# EAGLE design Grove - Serial MP3 Player (EAGLE 6.3)
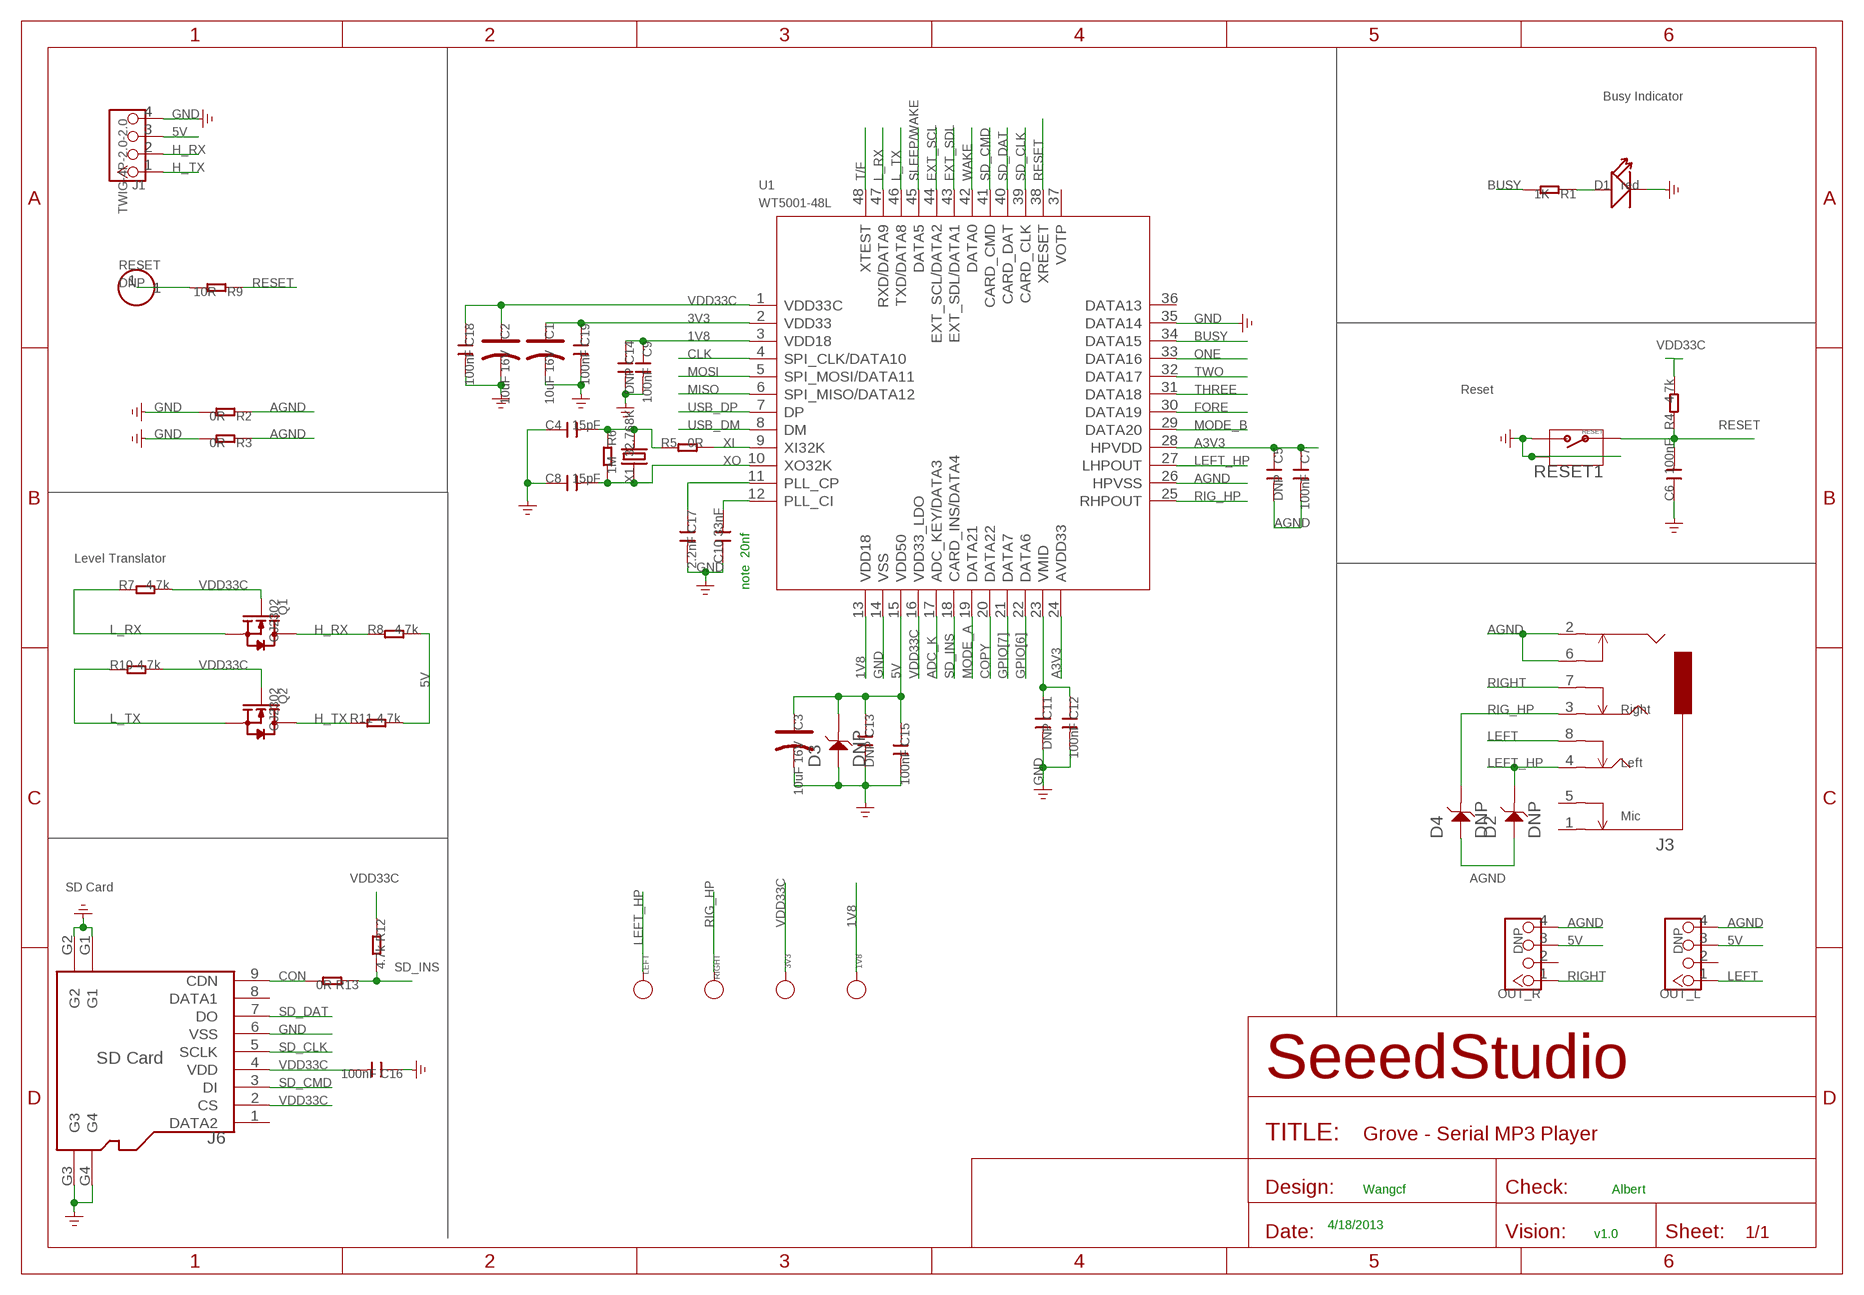
[diagram p0: schematic, sheet 1]

## Parts
1V8  PAD-TEST-POINT'4545'  [TP_4545]
3V3  PAD-TEST-POINT'4545'  [TP_4545]
C1  10uF 16V  CAP-AVX-A  [AVX-A]
C2  10uF 16V  CAP-AVX-A  [AVX-A]
C3  10uF 16V  CAP-AVX-A  [AVX-A]
C4  15pF  C-0603  [C0603]
C5  DNP  C-0805  [C0805]
C6  100nF  C-0603  [C0603]
C7  100nF  C-0603  [C0603]
C8  15pF  C-0603  [C0603]
C9  100nF  C-0603  [C0603]
C10  33nF  C-0603  [C0603]
C11  DNP  C-0805  [C0805]
C12  100nF  C-0603  [C0603]
C13  DNP  C-0805  [C0805]
C14  DNP  C-0805  [C0805]
C15  100nF  C-0603  [C0603]
C16  100nF  C-0603  [C0603]
C17  2.2nF  C-0603  [C0603]
C18  100nF  C-0603  [C0603]
C19  100nF  C-0603  [C0603]
D1  red  LED'0603'  [LED-0603]
D2  DNP  D-ESD-2P'CESD5V0D1'  [SOD123-2.7X1.6]
D3  DNP  D-ESD-2P'CESD5V0D1'  [SOD123-2.7X1.6]
D4  DNP  D-ESD-2P'CESD5V0D1'  [SOD123-2.7X1.6]
J1  TWIG-4P-2.0-2.0  [4P-2.0]
J3  AUDIO-8P-SMD'PJ-3536-L6S'  [8P-3.5-SMD]
J6  SD Card  HOLDER-MICROSD-9P  [9P-SMD-W/-RING]
LEFT  PAD-TEST-POINT'4545'  [TP_4545]
OUT_L  DNP  TWIG-4P-2.0-2.0  [4P-2.0]
OUT_R  DNP  TWIG-4P-2.0-2.0  [4P-2.0]
Q1  CJ2302  MOSFET-N'SOT23'  [SOT23]
Q2  CJ2302  MOSFET-N'SOT23'  [SOT23]
R1  1K  R-0603  [R0603]
R2  0R  R-0603  [R0603]
R3  0R  R-0603  [R0603]
R4  4.7k  R-0603  [R0603]
R5  0R  R-0603  [R0603]
R6  1M  R-0603  [R0603]
R7  4.7k  R-0603  [R0603]
R8  4.7k  R-0603  [R0603]
R9  10R  R-0603  [R0603]
R10  4.7k  R-0603  [R0603]
R11  4.7k  R-0603  [R0603]
R12  4.7k  R-0603  [R0603]
R13  0R  R-0603  [R0603]
RESET  DNP  HEADER-1P-35  [1P-65/35MIL]
RESET1  RESET  BUTTON-4P-REINFORCE'TS-1188E'  [4P-SMD-7X3.5X3.5H]
RIGHT  PAD-TEST-POINT'4545'  [TP_4545]
U1  WT5001-48L  [TQFP48]
X1  32.768K  CRYSTAL-3215  [2P-SMD-3.2X1.5]

## Nets
1V8: 1V8.T C9.1 C14.1 U1.3(VDD18) U1.13(VDD18)
3V3: C1.+ C19.1 U1.2(VDD33)
5V: C3.+ C13.1 C15.1 D3.2 J1.3 OUT_L.3 OUT_R.3 R8.2 R11.2 U1.15(VDD50)
A3V3: C5.1 C7.1 U1.24(AVDD33) U1.28(HPVDD)
ADC_K: U1.17(ADC_KEY/DATA3)
AGND: C5.2 C7.2 D2.1 D4.1 J3.2 J3.6 OUT_L.4 OUT_R.4 R2.1 R3.1 U1.26(HPVSS)
BUSY: R1.2 U1.34(DATA15)
CLK: U1.4(SPI_CLK/DATA10)
CON: J6.9(CDN) R13.2
COPY: U1.20(DATA22)
EXT_SCL: U1.44(EXT_SCL/DATA2)
EXT_SDL: U1.43(EXT_SDL/DATA1)
FORE: U1.30(DATA19)
GND: C1.- C2.- C3.- C4.1 C6.1 C8.1 C9.2 C10.1 C11.2 C12.2 C13.2 C14.2 C15.2 C16.1 C17.2 C18.2 C19.2 D1.- D3.1 J1.4 J6.6(VSS) J6.G1 J6.G2 J6.G3 J6.G4 R2.2 R3.2 RESET1.2 RESET1.S1 RESET1.S2 U1.14(VSS) U1.35(DATA14)
GPIO[6]: U1.22(DATA6)
GPIO[7]: U1.21(DATA7)
H_RX: J1.2 Q1.3(D) R8.1
H_TX: J1.1 Q2.3(D) R11.1
L_RX: Q1.2(S) R7.1 U1.47(RXD/DATA9)
L_TX: Q2.2(S) R10.1 U1.46(TXD/DATA8)
LEFT: J3.8 OUT_L.1
LEFT_HP: D2.2 J3.4 LEFT.T U1.27(LHPOUT)
LL: C4.2 R5.1 R6.1 X1.2
MISO: U1.6(SPI_MISO/DATA12)
MODE_A: U1.19(DATA21)
MODE_B: U1.29(DATA20)
MOSI: U1.5(SPI_MOSI/DATA11)
N$1: C17.1 U1.11(PLL_CP)
N$2: C10.2 U1.12(PLL_CI)
N$3: C11.1 C12.1 U1.23(VMID)
N$4: R9.2 RESET.1
N$10: D1.+ R1.1
ONE: U1.33(DATA16)
RESET: C6.2 R4.1 R9.1 RESET1.1 U1.38(XRESET)
RIG_HP: D4.2 J3.3 RIGHT.T U1.25(RHPOUT)
RIGHT: J3.7 OUT_R.1
SD_CLK: J6.5(SCLK) U1.39(CARD_CLK)
SD_CMD: J6.3(DI) U1.41(CARD_CMD)
SD_DAT: J6.7(DO) U1.40(CARD_DAT)
SD_INS: R12.2 R13.1 U1.18(CARD_INS/DATA4)
SLEEP/WAKE: U1.45(DATA5)
T/F: U1.48(XTEST)
THREE: U1.31(DATA18)
TWO: U1.32(DATA17)
USB_DM: U1.8(DM)
USB_DP: U1.7(DP)
VDD33C: 3V3.T C2.+ C16.2 C18.1 J6.2(CS) J6.4(VDD) Q1.1(G) Q2.1(G) R4.2 R7.2 R10.2 R12.1 U1.1(VDD33C) U1.16(VDD33_LDO)
WAKE: U1.42(DATA0)
XI: R5.2 U1.9(XI32K)
XO: C8.2 R6.2 U1.10(XO32K) X1.1
Unconnected: J3.1 J3.5 J6.1(DATA2) J6.8(DATA1) OUT_L.2 OUT_R.2 U1.36(DATA13) U1.37(VOTP)

## Notes on the sheet
- Busy Indicator
- Reset
- Level Translator
- note  20nf
- Right
- Left
- Mic
- SD Card
- Wangcf | Albert
- 4/18/2013
- v1.0

## Library data of the parts
1V8 3V3 LEFT RIGHT = Discrete:PAD-TEST-POINT; PARTNO: DNP
C1-C3 = Discrete:CAP*: Electrolytic Capacitors,Tantalum Capacitors and Super Capacitors
C4-C19 = Discrete:C*: Ceramic Capacitors
D1 = Discrete:LED*
D2-D4 = Discrete:D-ESD-2P: Diodes for Protectiong against ESD
J1 OUT_L OUT_R = Connector:TWIG-4P-2.0
J3 = Connector:AUDIO-8P-SMD
J6 = Connector:HOLDER-MICROSD-9P
Q1 Q2 = Discrete:MOSFET-N: IRLL014: http://www.vishay.com/docs/91319/sihll014.pdf
R1-R13 = Discrete:R*
RESET = Connector:HEADER-1P
RESET1 = Discrete:BUTTON-4P-REINFORCE: TS-1188E http://www.best-dz.com/?thread-374-2.html
U1 = template:WT5001-48L
X1 = Discrete:CRYSTAL*: CRYSTAL

## Net classes
0 default: width 0.152 mm, drill 0.305 mm, clearance 0.152 mm

## Board
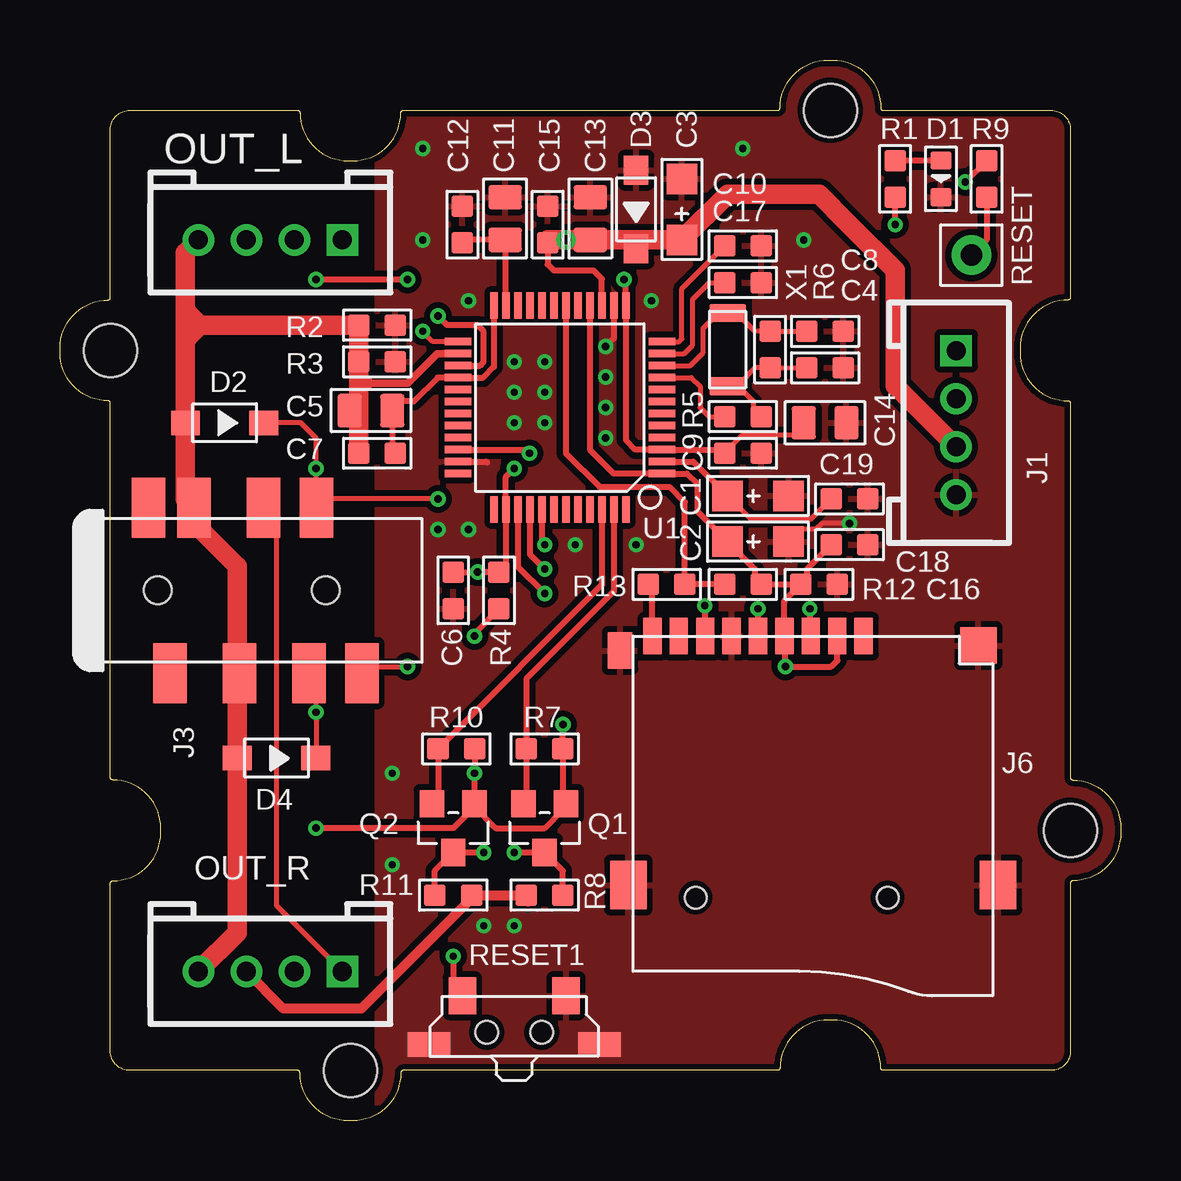
[diagram p1: board, top side]
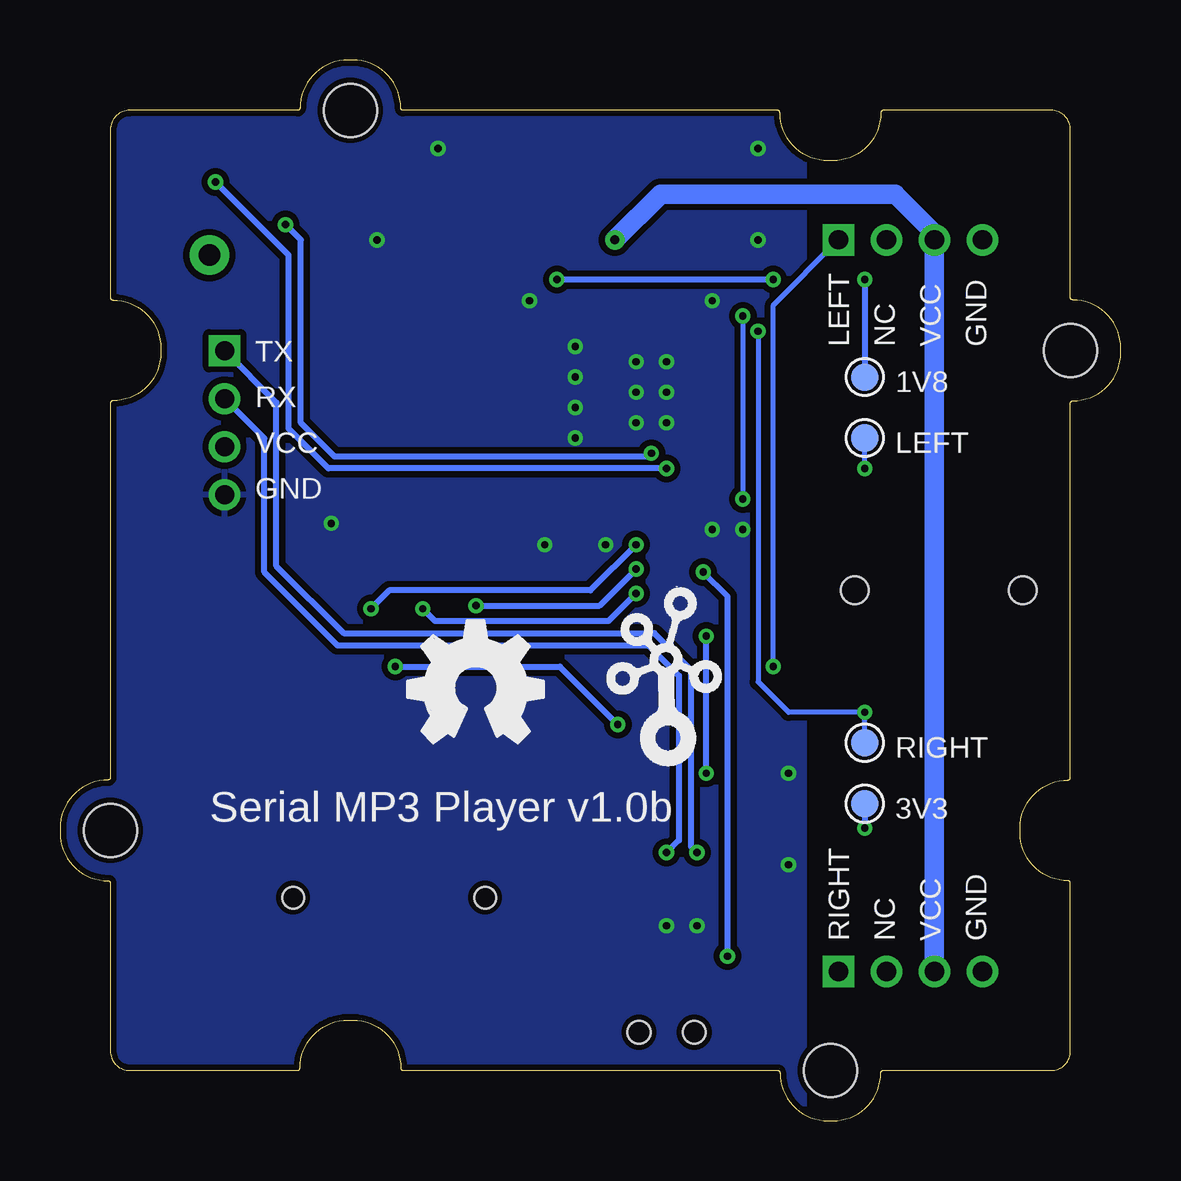
[diagram p2: board, bottom side, seen from below]

Size 44.2 x 44.2 mm. Coordinates in mm from the lower left corner, seen from the top.
Copper layers (1*16): Top 0.035mm / dielectric 1.5mm / Bottom 0.035mm
Design rules "SeeedStudio_rule_no_angle_090911 *": minimum track width 6mil, minimum drill 12mil, track to track 6mil, track to pad 6mil, pad to pad 6mil, via to via 6mil, smd to smd 0mil, copper to edge 10mil, drill to drill 10mil, minimum pad ring 10mil, minimum via ring 6mil, stop-mask expansion 2mil, vias tented up to drill 25mil, thermal gap 10mil

### Footprints (pad centres in the part's own frame; a part is rotated, then mirrored left to right if it is on the bottom)
TP_4545 = smd 1.143 x 1.143: T 0,0
AVX-A = smd 1.27 x 1.27: + -1.27,0; - 1.27,0
C0603 = smd 0.889 x 0.889: 1 -0.762,0; 2 0.762,0
C0805 = smd 1.016 x 1.397: 1 -0.889,0; 2 0.889,0
LED-0603 = smd 0.762 x 0.889: + -0.762,0; - 0.762,0
SOD123-2.7X1.6 = smd 1.2 x 1.02: 1 -1.635,0; 2 1.635,0
4P-2.0 = drill 0.8 pad 1.27 square: 1 -3,0 | drill 0.8 pad 1.27: 2 -1,0; 3 1,0; 4 3,0
8P-3.5-SMD = smd 1.4 x 2.5: 1 2.8,-3.45; 2 5.7,-3.45; 3 8.6,-3.45; 4 8.9,3.45; 5 1.9,3.45; 6 3.8,3.45; 7 6.7,3.45; 8 10.8,-3.45 | hole 1.149: 2.3,0; 9.3,0
9P-SMD-W/-RING = smd 1.524 x 0.762: 1 0,4.4; 2 0,3.3; 3 0,2.2; 4 0,1.1; 5 0,0; 6 0,-1.1; 7 0,-2.2; 8 0,-3.3; 9 0,-4.4 | smd 1.524 x 1.016: G1 0.6,-5.746 | smd 2.032 x 1.524: G2 10.373,-5.4; G3 10.373,10 | smd 1.524 x 1.524: G4 0.392,9.181 | hole 0.889: 10.9,-2.6; 10.9,5.4
SOT23 = smd 1.016 x 1.143: 1 -0.889,-1.016; 2 0.889,-1.016; 3 0,1.016
R0603 = smd 0.889 x 0.889: 1 -0.762,0; 2 0.762,0
1P-65/35MIL = drill 0.889 pad 1.651: 1 0,0
4P-SMD-7X3.5X3.5H = smd 1.143 x 1.524: 1 -2.159,1.524; 2 2.159,1.524 | smd 1.778 x 1.016: S1 -3.556,-0.508; S2 3.556,-0.508 | hole 0.95: -1.15,0; 1.15,0
TQFP48 = smd 1.1 x 0.3: 1 -4.25,2.75; 2 -4.25,2.25; 3 -4.25,1.75; 4 -4.25,1.25; 5 -4.25,0.75; 6 -4.25,0.25; 7 -4.25,-0.25; 8 -4.25,-0.75; 9 -4.25,-1.25; 10 -4.25,-1.75; 11 -4.25,-2.25; 12 -4.25,-2.75; 25 4.25,-2.75; 26 4.25,-2.25; 27 4.25,-1.75; 28 4.25,-1.25; 29 4.25,-0.75; 30 4.25,-0.25; 31 4.25,0.25; 32 4.25,0.75; 33 4.25,1.25; 34 4.25,1.75; 35 4.25,2.25; 36 4.25,2.75 | smd 0.3 x 1.1: 13 -2.75,-4.25; 14 -2.25,-4.25; 15 -1.75,-4.25; 16 -1.25,-4.25; 17 -0.75,-4.25; 18 -0.25,-4.25; 19 0.25,-4.25; 20 0.75,-4.25; 21 1.25,-4.25; 22 1.75,-4.25; 23 2.25,-4.25; 24 2.75,-4.25; 37 2.75,4.25; 38 2.25,4.25; 39 1.75,4.25; 40 1.25,4.25; 41 0.75,4.25; 42 0.25,4.25; 43 -0.25,4.25; 44 -0.75,4.25; 45 -1.25,4.25; 46 -1.75,4.25; 47 -2.25,4.25; 48 -2.75,4.25
2X2U-DIM-W/-DRILL = hole 2.2: 10,20; -20,10; -10,-20; 20,-10
2P-SMD-3.2X1.5 = smd 0.762 x 1.524: 1 -1.524,0; 2 1.524,0

### Placement (x,y rotation side)
1V8  10.67,30.99 0 bottom
3V3  10.67,13.21 0 bottom
C1  29.09,26.04 0 top
C2  29.09,24.13 0 top
C3  25.91,37.98 90 top
C4  31.88,31.37 180 top
C5  12.96,29.59 180 top
C6  16.39,22.1 90 top
C7  13.21,27.82 180 top
C8  31.88,32.9 180 top
C9  28.45,27.82 0 top
C10  28.45,36.45 180 top
C11  18.54,37.59 90 top
C12  16.77,37.34 90 top
C13  22.1,37.59 90 top
C14  31.88,29.09 0 top
C15  20.32,37.34 90 top
C16  31.62,22.35 180 top
C17  28.45,34.93 0 top
C18  32.9,24.01 0 top
C19  32.9,25.91 0 top
D1  36.7,39.25 270 top
D2  6.86,29.09 0 top
D3  24.01,37.98 270 top
D4  9.02,15.12 0 top
J1  37.34,29.09 270 top
J3  1.78,22.1 0 top
J6  29.09,20.2 270 top
LEFT  10.67,28.45 0 bottom
OUT_L  8.77,36.7 180 top
OUT_R  8.77,6.23 180 top
Q1  20.2,12.19 180 top
Q2  16.39,12.19 180 top
R1  34.8,39.25 270 top
R2  13.21,33.15 0 top
R3  13.21,31.62 0 top
R4  18.29,22.1 270 top
R5  28.45,29.34 180 top
R6  29.59,32.13 90 top
R7  20.2,15.5 0 top
R8  20.2,9.4 180 top
R9  38.61,39.25 270 top
R10  16.51,15.5 0 top
R11  16.39,9.4 0 top
R12  28.45,22.35 180 top
R13  25.28,22.35 180 top
RESET  37.98,36.07 270 top
RESET1  18.93,3.69 0 top
RIGHT  10.67,15.75 0 bottom
U1  20.83,29.72 180 top
U$13  [TWIGLOGO]  18.93,15.75 0 bottom
U$20  [2X2U-DIM-W/-DRILL]  22.1,22.1 90 top
U$21  [OSHW_FILLX200_NOTEXT]  29.72,15.75 0 bottom
X1  27.82,32.13 270 top

### Tracks (layer width: path | path; a pad name or v marks a point on that pad's centre or on a via)
1V8  (via drill 0.3 pad 0.64)
  Top 0.203: C9.1 28.45,28.58 30.86,28.58 30.99,28.7 C14.1
  Top 0.254: C9.1 27.53,27.97 U1.3 23.98,27.97 23.58,28.37 U1.13 23.58,34.97 v23.5,35.05 | v14.48,35.05 v10.67,35.05
  Bottom 0.254: v10.67,35.05 1V8.T | v14.48,35.05 v23.5,35.05
3V3
  Top 0.203: C1.+ 28.77,25.09 31.31,25.09 C19.1
  Top 0.254: U1.2 26.38,27.47 C1.+
5V  (via drill 0.38 pad 0.81)
  Top 0.254: C15.1 20.32,35.69 20.58,35.44 22.23,35.44 22.58,35.08 U1.15
  Top 0.406: 19.5,9.15 19.5,9.34 R8.2 R11.2 17.15,9.27 12.55,4.68 9.31,4.68 OUT_R.3
  Top 0.813: 24.13,36.7 C3.+ 27.82,38.61 31.62,38.61 32.83,37.4 32.9,37.34 34.8,35.44 34.8,30.62 J1.3 | 24.13,36.7 C13.1 v21.08,36.7 20.32,36.7 C15.1 | D3.2 24.01,36.58 24.13,36.7
  Bottom 0.813: OUT_R.3 OUT_L.3 7.77,36.98 9.4,38.61 19.18,38.61 v21.08,36.7
A3V3
  Top 0.254: U1.24 18.08,31.41 17.64,30.97 U1.28 15.73,30.97 14.73,29.97 13.85,29.97 C5.1 13.85,27.94 C7.1
AGND
  Top 0.203: R3.1 12.45,31.37 12.7,31.37 12.7,30.99 | 12.32,29.85 12.45,29.97 12.7,30.23 12.7,30.48 | 12.32,29.85 C5.2 | 12.45,29.72 12.32,29.85
  Top 0.305: U1.26 15.71,31.97 14.48,30.74 12.96,30.74 | 12.96,30.74 12.45,30.74 | 12.96,30.74 12.7,30.48 | 12.96,30.74 12.7,30.99
  Top 0.813: R3.1 R2.1 5.84,33.15 | 12.45,31.37 12.45,29.97 C7.2 | 7.38,18.55 D4.1 7.38,7.84 OUT_R.4 | 7.38,18.55 J3.2 | 7.38,18.55 7.38,23.1 5.59,24.89 J3.6 5.23,25.91 D2.1 5.23,33.15 | 5.23,33.15 5.23,36.16 OUT_L.4 | 5.84,33.15 5.23,33.15 | 5.84,33.15 5.34,33.66 5.34,32.64 5.84,33.15
BUSY  (via drill 0.3 pad 0.64)
  Top 0.254: U1.34 19.41,27.97 v19.56,27.82 | v34.8,37.34 R1.2
  Bottom 0.254: v19.56,27.82 19.69,27.69 32.77,27.69 34.16,29.09 34.16,36.7 v34.8,37.34
CON
  Top 0.254: J6.9 24.69,22.53 R13.2
GND  (via drill 0.3 pad 0.64)
  Top 0.203: v32.9,24.89 31.75,24.89 31.5,24.64 30.36,24.64 C2.-
  Top 0.254: U1.35 17.75,27.47 17.78,27.43 | U1.14 23.08,32.61 v22.74,32.26
  other vias: 20.2,30.36 20.2,29.09 18.93,29.09 13.85,10.67 24.01,24.01 15.75,24.64 17.02,34.16 24.64,34.16 17.02,24.64 15.12,40.52 15.12,36.7 21.46,24.01 18.93,30.36 18.93,31.62 20.2,31.62 22.74,30.99 22.74,29.72 22.74,28.45 13.85,14.48 28.45,40.52 17.66,8.13 18.93,8.13 30.99,36.7
  pour Bottom (isolate 0.254): 13.21,33.66 13.21,-0.12 44.33,-0.12 44.33,44.33 13.21,44.33
  pour Top (isolate 0.254): 13.21,33.53 13.21,-0.12 44.33,-0.12 44.33,44.33 13.21,44.33 13.21,33.66
H_RX  (via drill 0.3 pad 0.64)
  Top 0.254: R8.1 20.96,10.42 Q1.3 v18.93,11.18
  Bottom 0.254: J1.2 35.69,28.43 35.69,22.86 32.64,19.81 19.69,19.81 18.42,18.54 18.42,11.69 v18.93,11.18
H_TX  (via drill 0.3 pad 0.64)
  Top 0.254: R11.1 15.62,10.42 Q2.3 | 16.51,11.31 Q2.3 | v17.66,11.18 Q2.3
  Bottom 0.254: J1.1 35.18,29.93 35.18,23.12 32.39,20.32 19.43,20.32 17.91,18.8 17.91,11.43 v17.66,11.18
L_RX
  Top 0.254: Q1.2 19.43,13.34 R7.1 19.43,18.42 23.08,22.06 U1.47
L_TX
  Top 0.254: Q2.2 15.75,13.21 R10.1 22.58,22.33 U1.46
LEFT  (via drill 0.3 pad 0.64)
  Top 0.203: J3.8 12.68,18.65 12.96,18.93 v14.48,18.93
  Bottom 0.203: v14.48,18.93 14.48,33.99 OUT_L.1
LEFT_HP  (via drill 0.3 pad 0.64)
  Top 0.203: v15.75,25.91 10.67,25.91 v10.67,27.18 LEFT.T 10.04,29.09 D2.2
  Top 0.254: U1.27 17.5,31.47 17.66,31.62 17.66,32.9 17.4,33.15 16.13,33.15 v15.75,33.53 | 10.67,25.91 J3.4
  Bottom 0.203: v15.75,33.53 v15.75,25.91 | v10.67,27.18 LEFT.T
LL
  Top 0.203: C4.2 R6.1 28.96,31.37 28.32,30.74 27.94,30.74 X1.2 28.26,30.61 28.9,29.97 28.9,29.53 29.09,29.34 R5.1
N$1
  Top 0.203: U1.11 26.01,31.97 26.36,32.32 26.36,34.23 27.05,34.93 C17.1
N$2
  Top 0.203: C10.2 26.1,34.86 25.97,34.74 25.91,34.67 25.91,32.58 25.8,32.47 U1.12
N$3
  Top 0.254: U1.23 18.58,36.67 C11.1 16.77,36.7 C12.1
N$4
  Top 0.254: R9.2 38.61,36.7 RESET.1
N$10
  Top 0.254: D1.+ R1.1
RESET  (via drill 0.3 pad 0.64)
  Top 0.254: v16.39,6.86 16.39,5.59 RESET1.1 | C6.2 v17.4,22.86 R4.1 18.58,23.15 U1.38 18.58,26.84 v18.93,27.18 | R9.1 v37.72,39.12
  Bottom 0.254: v18.93,27.18 33.02,27.18 34.67,28.84 34.67,36.07 v37.72,39.12 | v16.39,6.86 16.39,21.85 v17.4,22.86
RIG_HP  (via drill 0.3 pad 0.64)
  Top 0.203: U1.25 15.54,32.47 v15.12,32.9 | J3.3 10.4,18.67 10.54,18.67 10.67,18.54 v10.67,17.02 10.67,15.13 D4.2
  Bottom 0.203: v15.12,32.9 15.12,18.29 13.85,17.02 v10.67,17.02 RIGHT.T
RIGHT
  Top 0.203: J3.7 8.79,25.55 9.02,25.78 9.02,8.97 OUT_R.1
SD_CLK  (via drill 0.3 pad 0.64)
  Top 0.254: J6.5 v29.09,21.34 | U1.39 19.08,23.09 v20.2,21.97
  Bottom 0.254: v29.09,21.34 28.58,20.83 21.34,20.83 v20.2,21.97
SD_CMD  (via drill 0.3 pad 0.64)
  Top 0.254: v31.24,21.34 31.24,20.24 J6.3 | U1.41 20.08,24.12 v20.2,24.01
  Bottom 0.254: v20.2,24.01 22.1,22.1 30.48,22.1 v31.24,21.34
SD_DAT  (via drill 0.3 pad 0.64)
  Top 0.254: U1.40 19.58,23.6 v20.2,22.99 | J6.7 26.89,21.44 v26.86,21.46
  Bottom 0.254: v26.86,21.46 21.72,21.46 v20.2,22.99
SD_INS
  Top 0.254: R12.2 R13.1 26.04,25.78 25.4,26.42 22.48,26.42 21.08,27.82 U1.18
VDD33C  (via drill 0.3 pad 0.64)
  Top 0.254: U1.16 22.08,27.96 23.07,26.97 U1.1 26.12,26.97 26.55,26.55 26.55,25.4 C2.+ 28.96,22.99 28.96,22.61 R12.1 C16.2 | 17.27,13.08 Q2.1 v17.27,14.48 R10.2 | 17.27,13.08 18.16,12.19 20.2,12.19 20.96,12.96 20.96,13.08 Q1.1 20.96,13.21 R7.2 v20.96,16.51 | v17.27,20.2 17.27,20.32 R4.2 | 17.27,13.08 16.39,12.19 v10.67,12.19 | C16.2 30.19,21.68 J6.4 30.23,20.15 v30.23,18.93 32.13,18.93 32.39,19.18 J6.2 | C18.1 31.12,22.99 31.12,22.48 30.99,22.35 C16.2
  Bottom 0.254: v17.27,14.48 v17.27,20.2 | v30.23,18.93 23.37,18.93 v20.96,16.51 | 3V3.T v10.67,12.19
XI
  Top 0.203: U1.9 26.31,30.97 26.67,30.61 26.67,29.72 27.05,29.34 R5.2
XO
  Top 0.203: U1.10 26.26,31.47 26.8,32.01 26.8,33.02 27.43,33.66 X1.1 27.94,33.53 28.32,33.53 28.96,32.9 R6.2 C8.2

### Text on the board
bPlace: GND | VCC | NC | LEFT | TX | RX | VCC | GND | Serial MP3 Player v1.0b | GND | VCC | NC | RIGHT